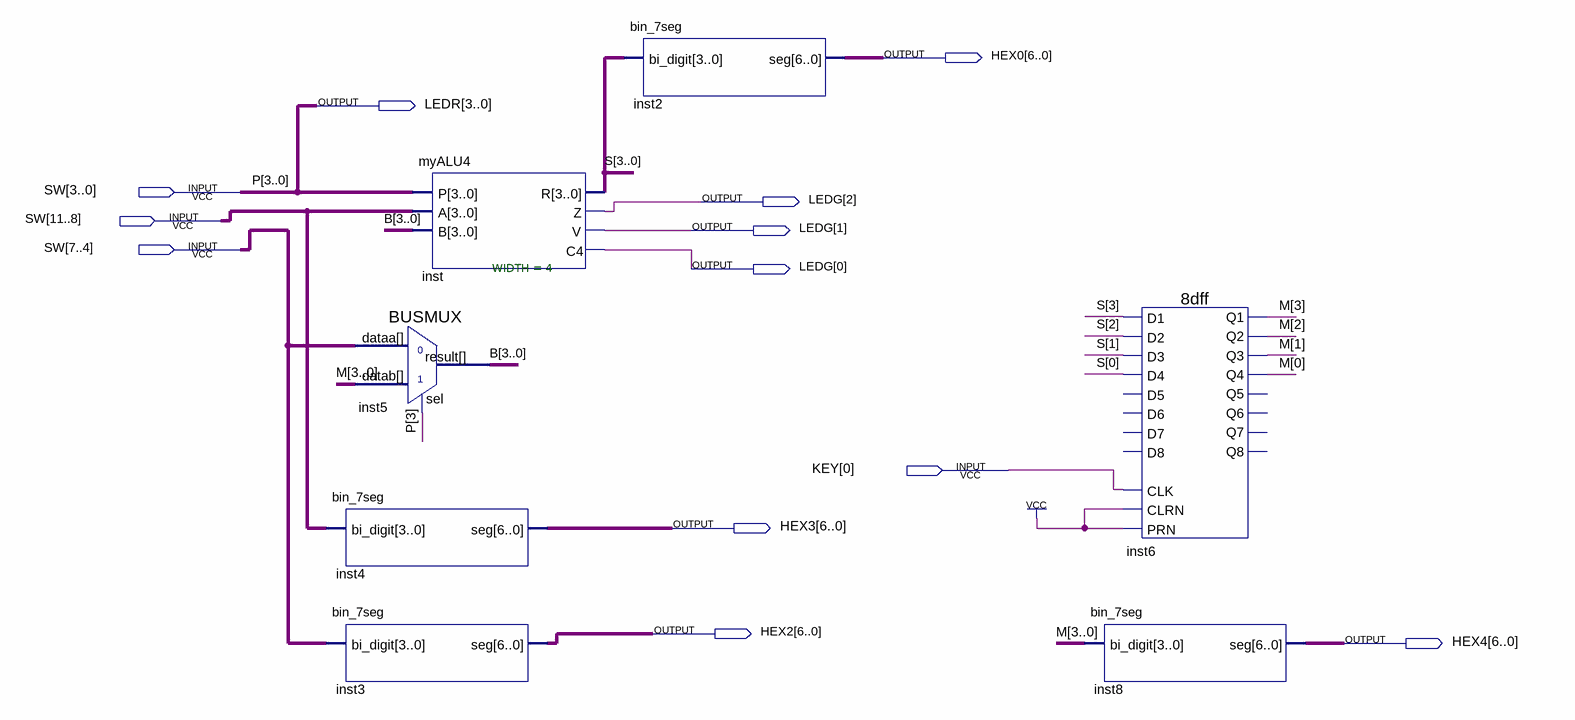
[diagram p0: schematic sheet]
// Quartus schematic Lab6.bdf as structural Verilog: 7 symbols, 12 pins
module Lab6 (
  input  [11:0] SW,
  input  [0:0] KEY,
  output [6:0] HEX0,
  output [3:0] LEDR,
  output [2:0] LEDG,
  output [6:0] HEX3,
  output [6:0] HEX2,
  output [6:0] HEX4
);

  wire [3:0] B, M, S;

  BUSMUX #(.WIDTH(4)) inst5 (.datab(M), .sel(SW[3]), .dataa(SW[7:4]), .result(B));
  bin_7seg inst4 (.bi_digit(SW[11:8]), .seg(HEX3));
  bin_7seg inst3 (.bi_digit(SW[7:4]), .seg(HEX2));
  myALU4 inst (.P(SW[3:0]), .A(SW[11:8]), .B(B), .R(S), .Z(LEDG[2]), .V(LEDG[1]), .C4(LEDG[0]));
  bin_7seg inst2 (.bi_digit(S), .seg(HEX0));
  \8dff  inst6 (
    .D4(S[0]), .D3(S[1]), .PRN(1'b1), .CLK(KEY[0]), .CLRN(1'b1), .D2(S[2]), .D1(S[3]), .Q1(M[3]), .Q4(M[0]),
    .Q3(M[1]), .Q2(M[2]));  // open: D5, D8, D7, D6, Q8, Q5, Q6, Q7
  bin_7seg inst8 (.bi_digit(M), .seg(HEX4));

  assign LEDR = SW[3:0];

  // Other names for the same wires on the sheet: P[3:0] = SW[3:0]
endmodule
